# EAGLE design lcheapo-v5 (EAGLE 7.5.0)
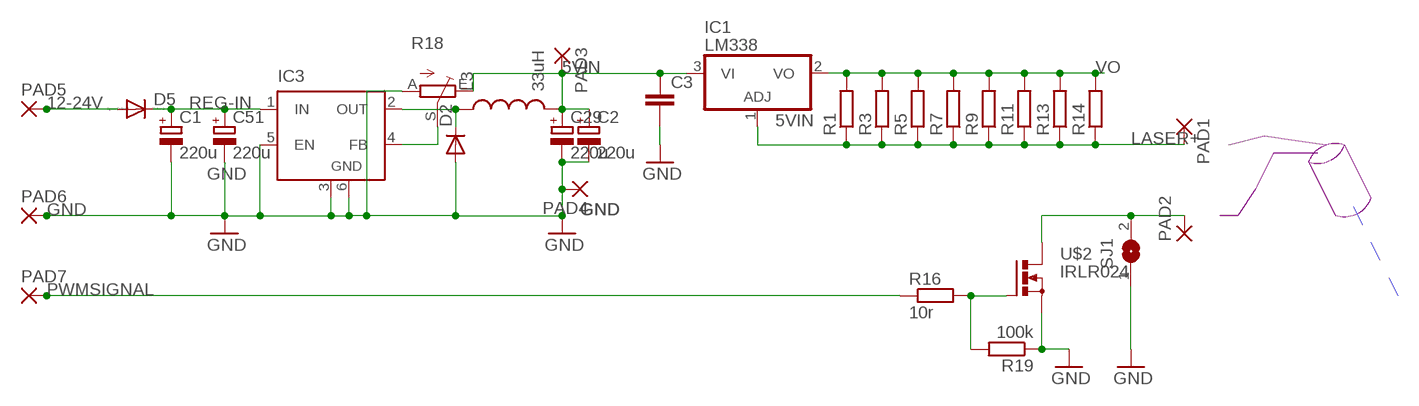
[diagram p0: schematic, sheet 1]

## Parts
C1  220u  CPOL-EUE2.5-7  [E2,5-7]
C2  220u  CPOL-EUD  [PANASONIC_D]
C3  C-EUC0603  [C0603]
C29  220u  CPOL-EUE2.5-7  [E2,5-7]
C51  220u  CPOL-EUD  [PANASONIC_D]
D2  DIODE-DO-214AC  [DO-214AC]
D5  DIODE-MELF-MLL41  [MELF-MLL41]
IC1  LM338  317T  [TO220H]
IC3  LM2596S  [TO263-5]
L3  33uH  INDUCTORPWR  [CDRH125]
PAD1  2,54/1,0  [2,54/1,0]
PAD2  2,54/1,0  [2,54/1,0]
PAD3  2,54/1,0  [2,54/1,0]
PAD4  2,54/1,0  [2,54/1,0]
PAD5  2,54/1,1  [2,54/1,1]
PAD6  2,54/1,1  [2,54/1,1]
PAD7  2,54/1,1  [2,54/1,1]
R1  R-EU_R2512  [R2512]
R3  R-EU_R2512  [R2512]
R5  R-EU_R2512  [R2512]
R7  R-EU_R2512  [R2512]
R9  R-EU_R2512  [R2512]
R11  R-EU_R2512  [R2512]
R13  R-EU_R2512  [R2512]
R14  R-EU_R2512  [R2512]
R16  10r  R-EU_R1206  [R1206]
R18  TRIM_EU-RJ9W  [RJ9W]
R19  100k  R-EU_R1206  [R1206]
SJ1  SJ  [SJ]
U$2  IRLR024  N-POWER-MOSFETDPAK-MOSFET  [D-PAK_TO252AA]

## Nets
2OUT: PAD2.1(P) SJ1.2 U$2.4(D)
5VIN: C2.+ C3.1 C29.+ IC1.3(VI) L3.2 PAD3.1(P) R18.E
12-24V: D5.A PAD5.1(P)
FEEDBACK: IC3.4(FB) R18.S
GND: C1.- C2.- C3.2 C29.- C51.- D2.2(A) IC3.3(GND) IC3.5(EN) IC3.6(GND) PAD4.1(P) PAD6.1(P) R18.A R19.1 SJ1.1 U$2.3(S)
LASER+: IC1.1(ADJ) PAD1.1(P) R1.1 R3.1 R5.1 R7.1 R9.1 R11.1 R13.1 R14.1
N$20: R16.2 R19.2 U$2.1(G)
N$50: D2.1(C) IC3.2(OUT) L3.1
PWMSIGNAL: PAD7.1(P) R16.1
REG-IN: C1.+ C51.+ D5.C IC3.1(IN)
VO: IC1.2(VO) R1.2 R3.2 R5.2 R7.2 R9.2 R11.2 R13.2 R14.2

## Library data of the parts
C1 C2 C29 C51 = rcl:CPOL-EU: POLARIZED CAPACITOR, European symbol
C3 = rcl:C-EU: CAPACITOR, European symbol
D2 = dp_devices:DIODE: Various Diode Packages
D5 = diode:DIODE-: DIODE
IC1 = linear:*317: Positive VOLTAGE REGULATOR
IC3 = linear:LM2596S: STEP-DOWN VOLTAGE REGULATOR
L3 = SparkFun-Passives:INDUCTOR: Inductors Basic Inductor/Choke - 0603 and 1206. Footprints are not proven and vary greatly between part numbers. SRN6045- 33uH, 20% 1.4A SDR0403-560KL - 56uH, 10%, 500mA RMS/740mA peak
PAD1-PAD4 = wirepad:2,54/1,0: THROUGH-HOLE PAD
PAD5-PAD7 = wirepad:2,54/1,1: THROUGH-HOLE PAD
R1 R3 R5 R7 R9 R11 R13 R14 R16 R19 = resistor:R-EU_: RESISTOR, European symbol
R18 = pot:TRIM_EU-: POTENTIOMETER
SJ1 = jumper:SJ: SMD solder JUMPER
U$2 = Cohesion_parts:N-POWER-MOSFET

## Board
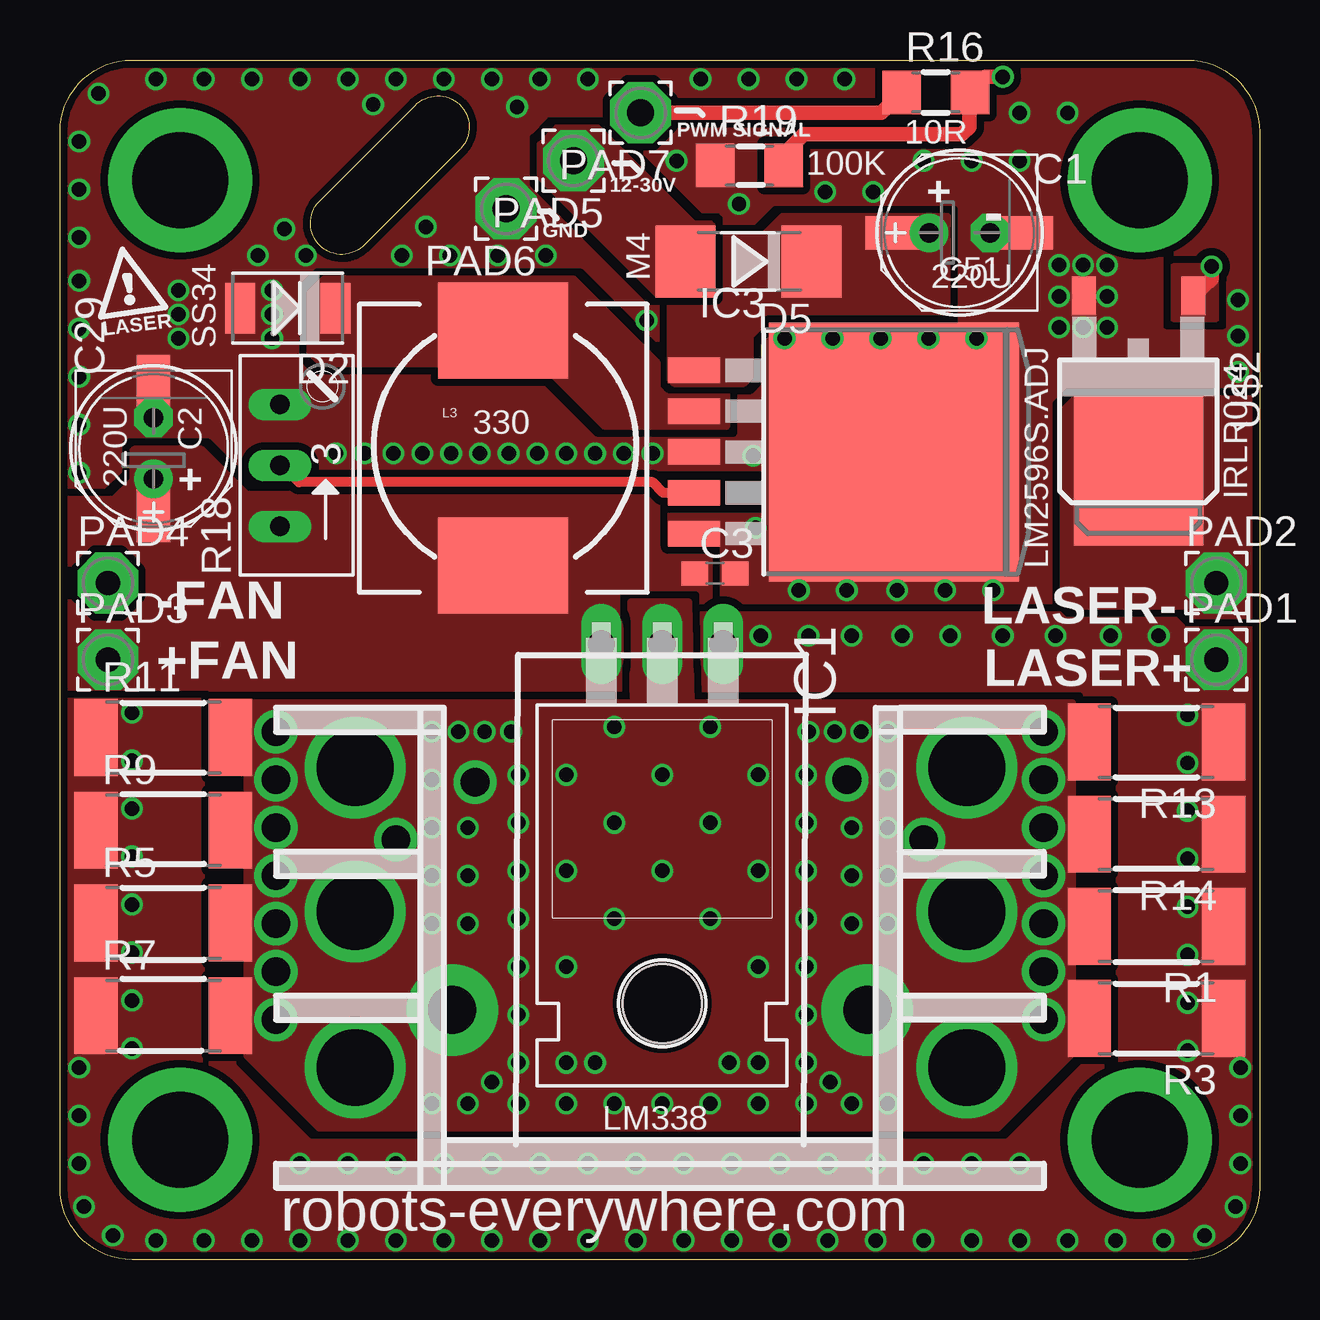
[diagram p1: board, top side]
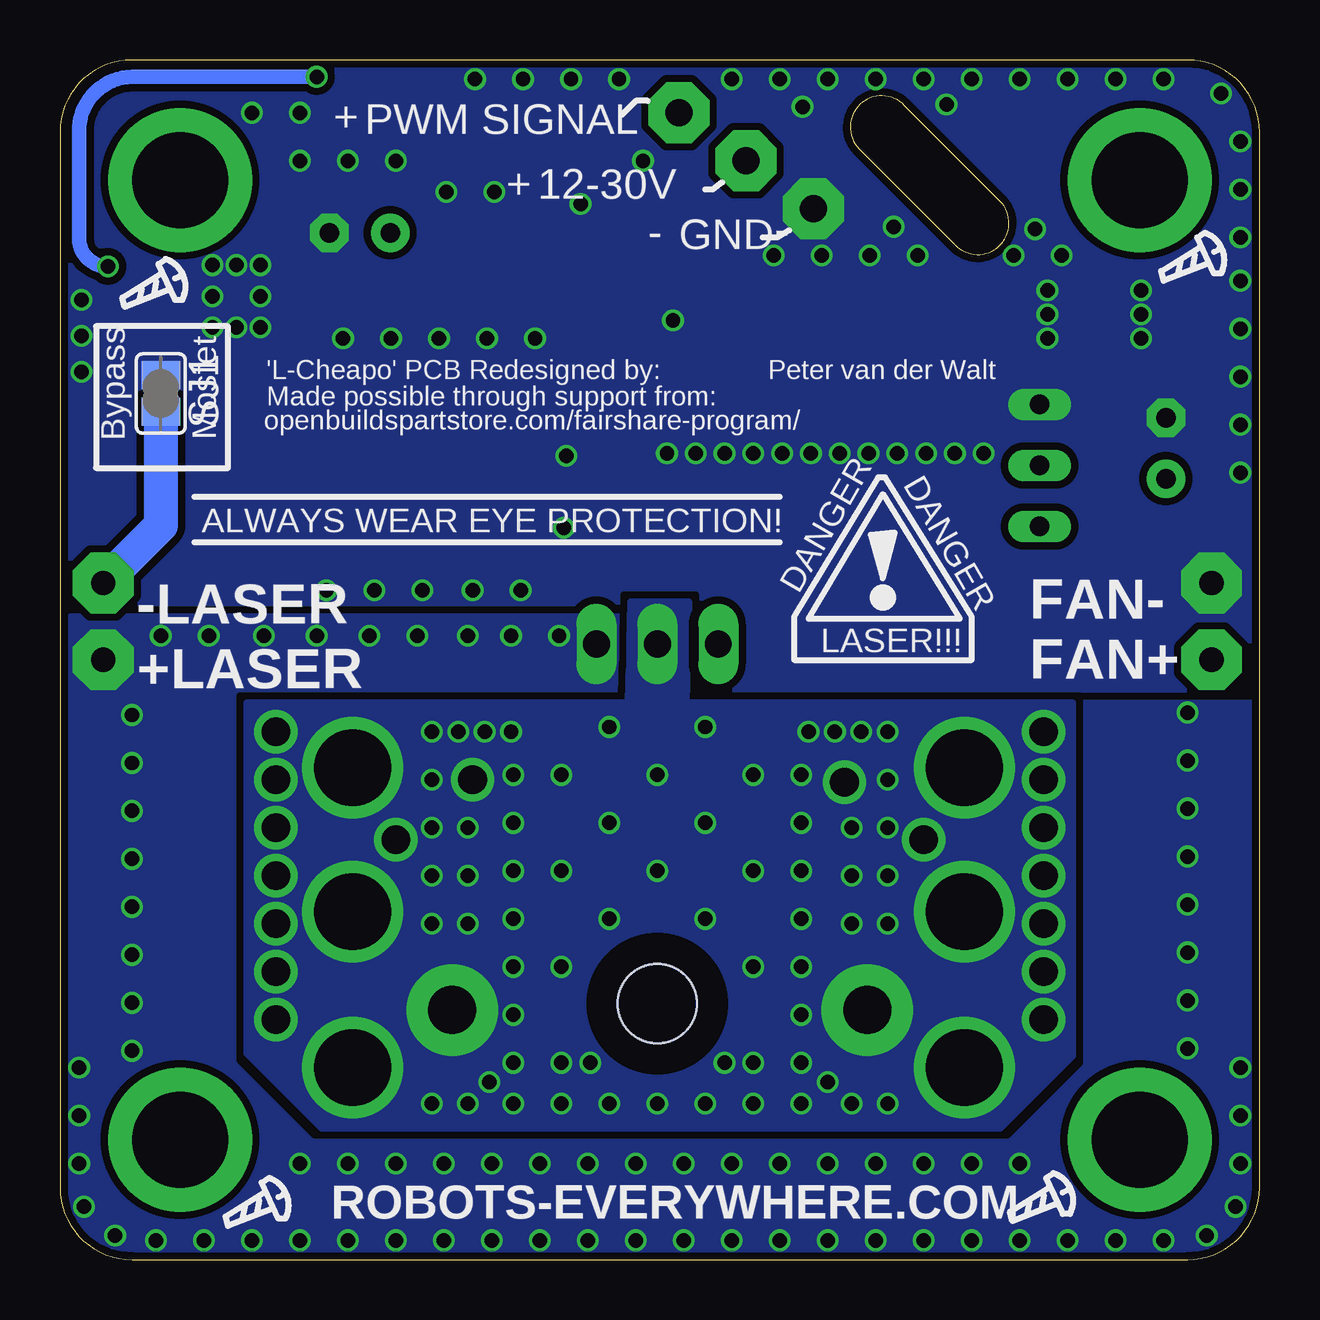
[diagram p2: board, bottom side, seen from below]

Size 50 x 50 mm. Coordinates in mm from the lower left corner, seen from the top.
Outline: 3,0 arc-90 0,3 0,47 arc-90 3,50 47,50 arc-90 50,47 50,3 arc-90 47,0 3,0
Outline: 14.8,48.1 arc-180 16.7,46.3 12.7,42.3 arc-180 10.8,44.1 14.8,48.1
Copper layers (1*16): Top 0.035mm / dielectric 1.5mm / Bottom 0.035mm
Design rules "dirt_cheap_dirty_boards.v1": minimum track width 5mil, minimum drill 12mil, track to track 5mil, track to pad 5mil, pad to pad 5mil, via to via 5mil, smd to smd 0mil, copper to edge 10mil, drill to drill 10mil, minimum pad ring 10mil, minimum via ring 6mil, stop-mask expansion 2mil, vias tented up to drill 25mil, thermal gap 10mil

### Footprints (pad centres in the part's own frame; a part is rotated, then mirrored left to right if it is on the bottom)
E2,5-7 = drill 0.813 pad 1.6: + -1.27,0 | drill 0.813 pad 1.6 octagon: - 1.27,0
PANASONIC_D = smd 3 x 1.4: + 2.4,0; - -2.4,0
C0603 = smd 1.1 x 1: 1 -0.85,0; 2 0.85,0
DO-214AC = smd 1.27 x 2.1: 1 -1.98,0; 2 1.98,0
MELF-MLL41 = smd 2.5 x 3: A 2.625,0; C -2.625,0
TO220H = drill 1.118 long: 1 -2.54,-10.16; 2 0,-10.16; 3 2.54,-10.16 | hole 3.302: 0,4.826
TO263-5 = smd 1.067 x 2.159: 1 -3.404,-5.791; 2 -1.702,-5.791; 3 0,-5.791; 4 1.702,-5.791; 5 3.404,-5.791 | smd 10.8 x 10.41: 6 0,2.54
CDRH125 = smd 5.4 x 4: 1 0,4.9; 2 0,-4.9
2,54/1,0 = drill 1.016 pad 2.54 octagon: 1 0,0
2,54/1,1 = drill 1.118 pad 2.54 octagon: 1 0,0
R2512 = smd 1.8 x 3.2: 1 -2.8,0; 2 2.8,0
R1206 = smd 1.6 x 1.803: 1 -1.422,0; 2 1.422,0
RJ9W = drill 0.813 long: A 2.54,0.635; E -2.54,0.635; S 0,0.635
SJ = smd 1.168 x 1.6: 1 -0.762,0; 2 0.762,0
D-PAK_TO252AA = smd 1 x 1.6: 1 -2.28,-4.8; 3 2.28,-4.8 | smd 5.4 x 6.2: 4 0,2.5

### Placement (x,y rotation side)
C1  37.5,42.8 0 top
C2  3.9,33.8 270 top
C3  27.3,28.6 0 top
C29  3.9,33.82 90 top
C51  37.48,42.8 180 top
D2  9.49,39.65 180 top
D5  28.7,41.6 180 top
IC1  25.1,15.5 180 top
IC3  32.22,33.66 270 top
L3  18.47,33.82 0 top
PAD1  48.2,25 0 top
PAD2  48.2,28.2 0 top
PAD3  2,25 0 top
PAD4  2,28.2 0 top
PAD5  21.4,45.8 180 top
PAD6  18.6,43.8 180 top
PAD7  24.2,47.8 180 top
R1  45.7,13.89 180 top
R3  45.7,10.05 180 top
R5  4.3,14.03 0 top
R7  4.3,10.17 0 top
R9  4.3,17.9 0 top
R11  4.3,21.76 0 top
R13  45.7,21.57 180 top
R14  45.7,17.73 180 top
R16  36.51,48.65 0 top
R18  9.8,33.1 90 top
R19  28.74,45.6 0 top
SJ1  45.8,36.1 270 bottom
U$2  44.95,35.36 180 top

### Tracks (layer width: path | path; a pad name or v marks a point on that pad's centre or on a via)
2OUT
  Bottom 1.422: SJ1.2 45.8,30.6 PAD2.1
  pour Top (isolate 0.305, no thermals): 42.3,35.9 49.6,35.9 49.65,26.8 47.3,26.8 46.9,27.2 42.3,27.2 41.8,27.7 41.8,35.4
5VIN
  pour Top (isolate 0.305, rank 3, no thermals): 24.9,31.7 24.7,31.9 7.8,31.9 5.9,33.8 3.1,33.8 3,33.7 3,32.5 2.2,31.7 0.1,31.7 0.1,23.8 23.7,23.8 23.6,27.4 27.1,27.3 27.1,29.4 25.2,29.4 24.9,29.7
12-24V
  pour Top (no thermals): 27.2,43.1 27.2,40.3 27.1,40.2 24.9,40.2 20.9,44.2 20,45.1 20,46.5 20.7,47.2 22.4,47.2 26.4,43.2 27.1,43.2
FEEDBACK
  Top 0.406: IC3.4 25.14,31.96 24.7,32.4 9.96,32.4 R18.S
GND  (via drill 0.6)
  other vias: 32.8,27.9 30.2,38.4 32.2,38.4 34.2,38.4 36.2,38.4 38.2,38.4 34.9,27.9 36.9,27.9 38.9,27.9 30.8,27.9 24.7,33.6 21.1,33.6 18.7,33.6 23.5,33.6 22.3,33.6 19.9,33.6 17.5,33.6 16.3,33.6 13.9,33.6 15.1,33.6 28.9,33.5 29,30.5 8.84,38.4 8.84,39.4 8.84,40.4 0.8,38.8 12.7,33.6 11.5,33.6 0.8,36.8 0.8,34.8 0.8,32.8 0.8,40.8 42.65,38.85 41.65,40.15 43.65,40.15 42.65,41.45 4.94,40.4 4.94,39.4 4.94,38.4 41.65,41.45 43.65,41.45 43.65,38.85 41.65,38.85 0.8,42.6 0.8,44.6 0.8,46.6 1.6,48.6 4,49.2 6,49.2 8,49.2 19.05,48.05 20.25,41.85 18.25,41.85 16.25,41.85 14.25,41.85 10.25,41.85 8.25,41.85 10,49.2 12,49.2 14,49.2 16,49.2 18,49.2 20,49.2 22,49.2 26.7,49.2 28.7,49.2 30.7,49.2 32.7,49.2 40,47.8 42,47.8 40,45.8 38,45.8 36,45.8 33.9,44.5 31.9,44.5 24.45,39.15 25.7,45.8 28.3,44 13.05,48.15 15.25,43.05 9.35,42.95 49.1,40 49.1,38.5 49.1,37
  pour Top (isolate 0.305, rank 6, no thermals): 0.1,32 1.9,32 2.5,32.6 2.5,33.9 2.8,34.2 6,34.2 6.8,33.1 7.6,33.1 7.7,33 29.4,33 29.5,33.1 29.5,31 25.3,31 25.3,29.6 27.5,29.6 27.5,27.3 41.7,27.3 41.4,27.6 41.4,35.5 42.3,36.4 49.8,36.4 49.8,48.2 48.2,49.8 2.2,49.8 0.2,47.8 0.2,41.2
  pour Bottom (isolate 0.305, rank 6, no thermals): 0.1,49.9 49.9,49.9 49.9,0.1 0.1,0.1
LASER+  (via drill 0.6)
  other vias: 29.2,26 31.2,26 33,26 35.1,26 40,0.8 38,0.8 36,0.8 34,0.8 32,0.8 30,0.8 28,0.8 26,0.8 24,0.8 22,0.8 20,0.8 18,0.8 16,0.8 14,0.8 12,0.8 10,0.8 8,0.8 42,0.8 37.1,26 39.3,26 41.5,26 43.8,26 45.8,26 44,0.8 46,0.8 47.7,1 49,2.2 49.2,4 49.2,6 49.2,8 6,0.8 4,0.8 2.2,1 1,2.2 0.8,4 0.8,6 0.8,8 3,8.8 3,10.8 3,12.8 3,14.8 3,16.8 3,18.8 3,20.8 3,22.8 47,8.7 47,10.7 47,12.7 47,14.7 47,16.7 47,18.7 47,20.7 47,22.7 10,4 12,4 14,4 16,4 18,4 20,4 22,4 24,4 26,4 28,4 30,4 32,4 34,4 36,4 38,4 40,4
  pour Bottom (isolate 0.305, rank 2, no thermals): 0.1,23.2 7.4,23.2 7.4,8.4 10.6,5.1 39.2,5.1 42.7,8.5 42.7,23.5 26.6,23.5 26.6,26.8 49.6,26.8 49.9,0.2 49.8,0.1 0.3,0.1 0.1,0.3
  pour Top (isolate 0.305, rank 2, no thermals): 0.2,23.3 7.5,23.3 7.5,8.5 10.7,5.2 39.3,5.2 42.8,8.6 42.8,23.6 26.7,23.6 26.7,26.9 49.7,26.9 50,0.3 49.9,0.2 0.4,0.2 0.2,0.4
N$3  (via drill 4 pad 6)
  other vias: 5,5
N$4  (via drill 4 pad 6)
  other vias: 45,5
N$5  (via drill 4 pad 6)
  other vias: 45,45
N$6  (via drill 4 pad 6)
  other vias: 5,45
N$20  (via drill 0.6)
  Top 0.61: v48,41.4 48,40.89 U$2.1 | v39.3,49.3 38.58,49.3 R16.2 37.9,48.62 37.9,47.2 37.6,46.9 31,46.9 30.16,46.06 R19.2
  Bottom 0.61: v39.3,49.3 47,49.3 arc-90 49.2,47 49.2,42.6 arc-95 v48,41.4
  pour Top (no thermals): 47.9,41.4 46.4,41.4 46.4,39.2 48.2,39.2 48.2,41.4
N$50
  pour Top (isolate 0.254, rank 4, no thermals): 11,40.9 21.4,40.9 24.9,37.4 24.9,36.4 27.8,36.4 27.8,34.7 22.7,34.7 20.1,37.3 10.9,37.3 10.4,37.8 10.4,40.3
PWMSIGNAL
  Top 0.61: PAD7.1 34.24,47.8 R16.1
REG-IN
  pour Top (isolate 0.305, no thermals): 27.6,42.7 27.6,40 27.5,39.9 25.6,39.9 25.4,39.7 25.4,36.7 25.6,36.5 28.5,36.5 28.8,36.8 28.8,38.5 29.6,39.3 37,39.3 37,43.5 30.1,43.5 29.3,42.7
VO  (via drill 0.6, 1.2, 2 pad 3.81, 3.2)
  other vias: 12.3,20.5 12.3,14.5 12.3,8 37.8,8 37.8,14.5 37.8,20.5 33.65,10.4 16.35,10.4 18.8,22 19.1,20.2 19.1,18.2 19.1,16.2 19.1,14.2 19.1,12.2 19.1,10.2 19.1,8.2 19.1,6.5 21.1,6.5 23.1,6.5 25.1,6.5 27.1,6.5 29.1,6.5 31.1,6.5 31.1,8.2 31.1,10.2 31.1,12.2 31.1,14.2 31.1,16.2 31.1,18.2 31.1,20.2 31.2,22 25.1,20.2 21.1,16.2 29.1,16.2 25.1,16.2 29.1,8.2 21.1,8.2 29.1,12.2 21.1,12.2 27.1,14.2 23.1,14.2 29.1,20.2 21.1,20.2 27.1,22.2 23.1,22.2 27.1,18.2 23.1,18.2 17.7,22 16.6,22 17,18 17,16 17,14 33,14 33,16 33,18 33.4,22 32.3,22 34.5,20 34.5,18 34.5,16 34.5,14 15.5,14 15.5,16 15.5,18 17,6.5 15.5,6.5 33,6.5 34.5,6.5 32.1,7.4 18,7.4 34.5,22 15.5,22 15.5,20 9,20 9,22 9,18 9,16 9,14 9,12 9,10 41,22 41,20 41,18 41,16 41,14 41,12 41,10 17.3,19.9 32.8,20 22.3,8.2 27.9,8.2 36,17.5 14,17.5
  pour Bottom (isolate 0.406, no thermals): 7.8,23.2 23.9,23.2 23.8,27.4 26.2,27.4 26.3,23.2 42.2,23.2 42.2,8.6 39.1,5.5 10.8,5.5 7.8,8.5
  pour Top (isolate 0.406, no thermals): 7.8,23.2 23.9,23.2 23.8,27.4 26.2,27.4 26.3,23.2 42.2,23.2 42.2,8.6 39.1,5.5 10.8,5.5 7.8,8.5

### Text on the board
tPlace: PWM SIGNAL | 10R | 100K | 12-30V | + | GND | - | 220U | M4 | LASER | SS34 | 330 | 220U | + | IRLR024 | LM2596S.ADJ | -FAN | LASER- | +FAN | LASER+ | LM338 | robots-everywhere.com
bPlace: PWM SIGNAL | + | 12-30V | + | - | GND | - | Bypass | Mosfet | Peter van der Walt | 'L-Cheapo' PCB Redesigned by: | Made possible through support from: | openbuildspartstore.com/fairshare-program/ | DANGER | ALWAYS WEAR EYE PROTECTION! | DANGER | FAN- | -LASER | LASER!!! | FAN+ | +LASER | ROBOTS-EVERYWHERE.COM